# EAGLE schematic vhdci-m2m-bmod (EAGLE 6.3)
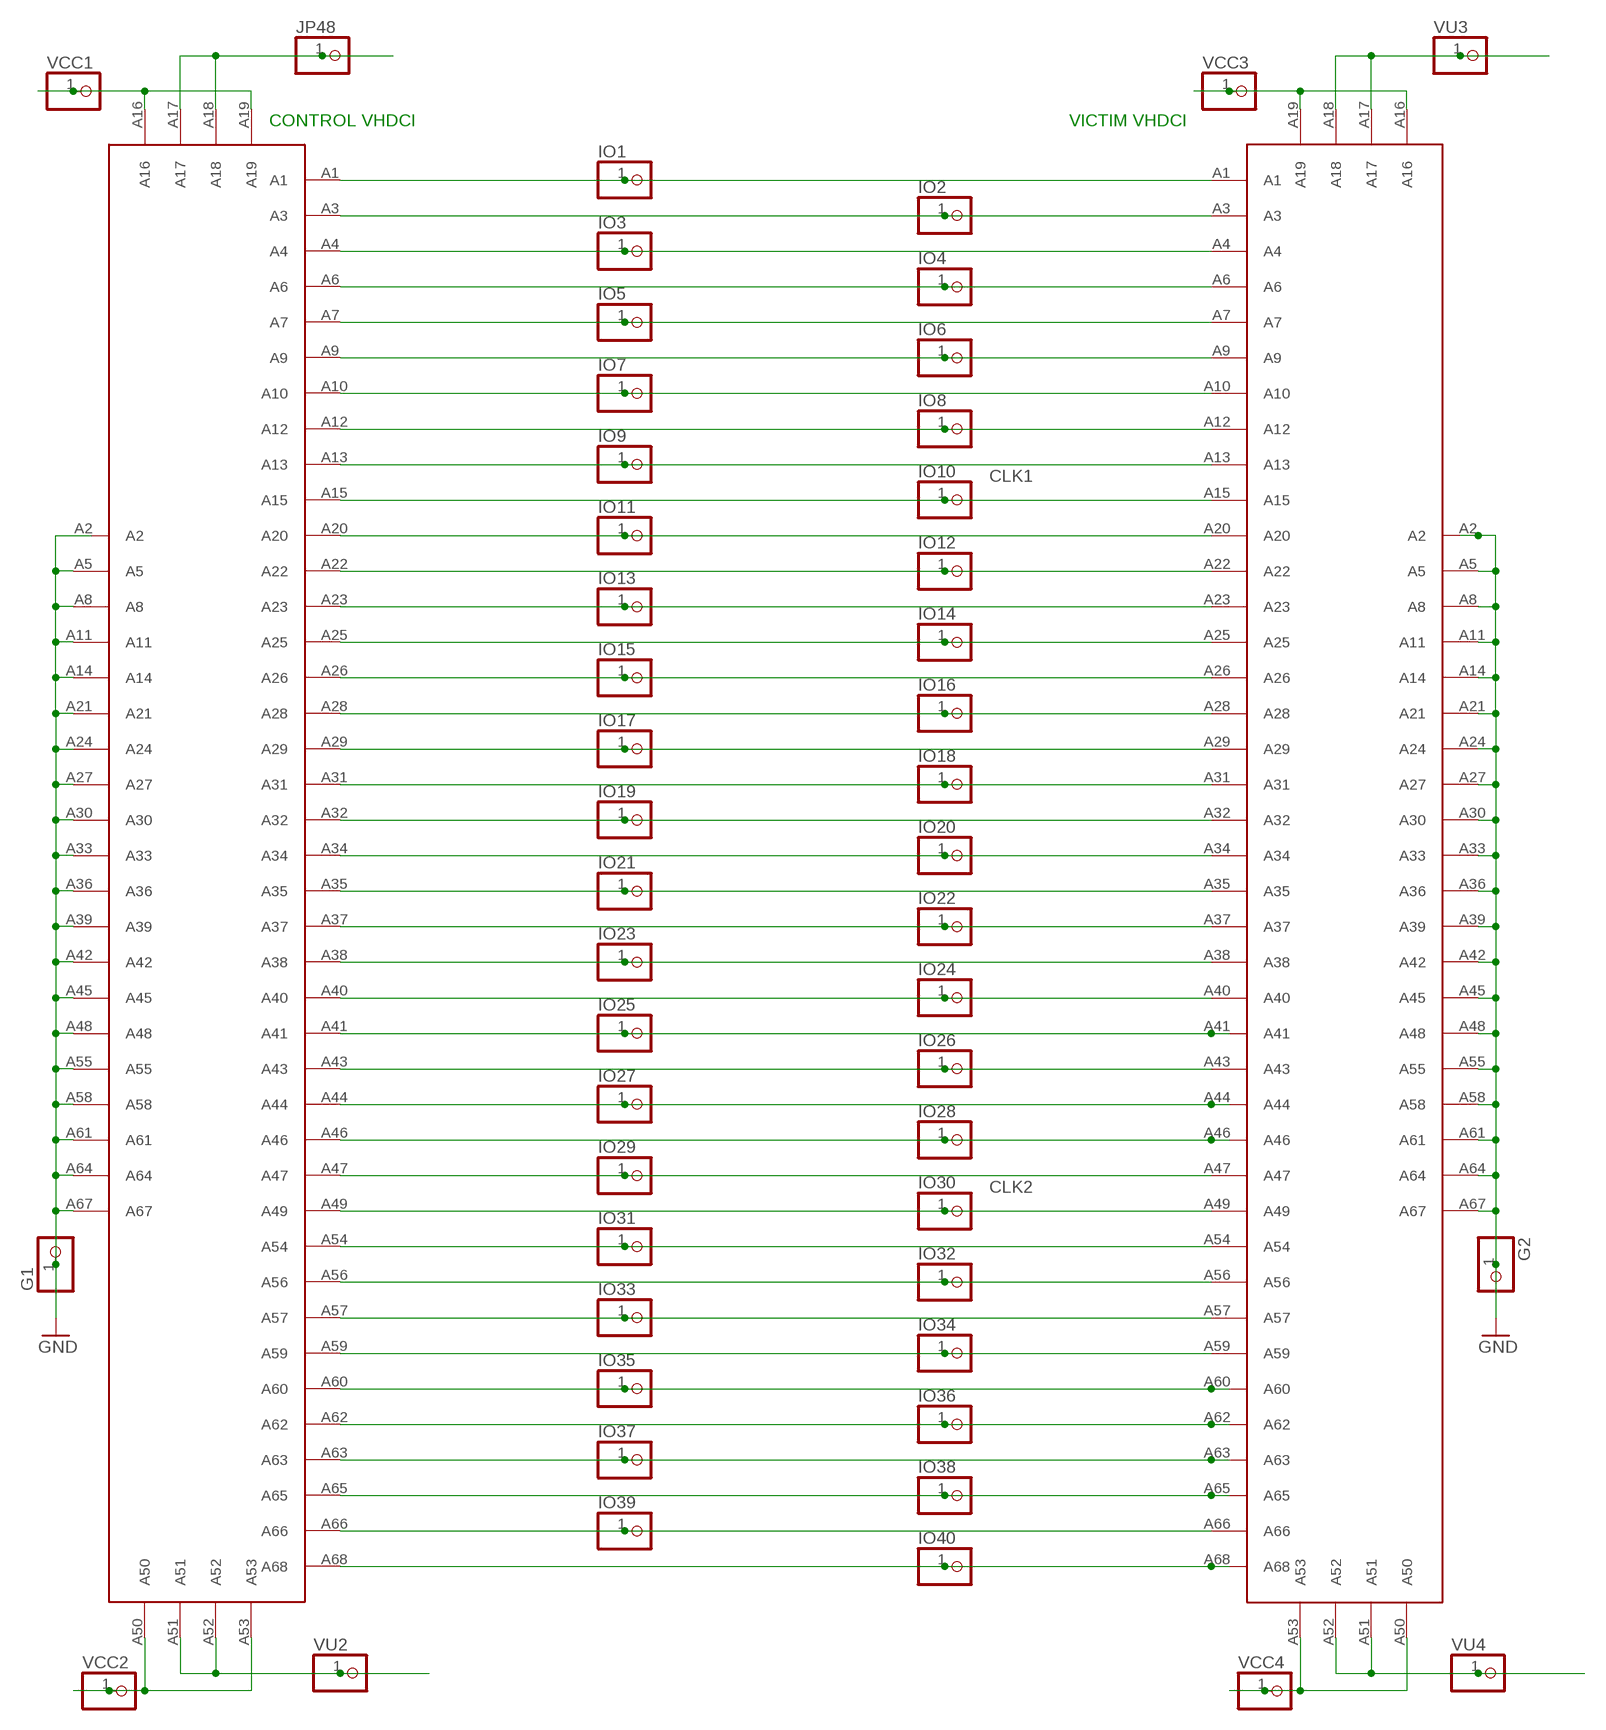
[diagram p0: schematic, sheet 1]

## Parts
G1  PINHD-1X1  [1X01]
G2  PINHD-1X1  [1X01]
IO1  PINHD-1X1  [1X01]
IO2  PINHD-1X1  [1X01]
IO3  PINHD-1X1  [1X01]
IO4  PINHD-1X1  [1X01]
IO5  PINHD-1X1  [1X01]
IO6  PINHD-1X1  [1X01]
IO7  PINHD-1X1  [1X01]
IO8  PINHD-1X1  [1X01]
IO9  PINHD-1X1  [1X01]
IO10  CLK1  PINHD-1X1  [1X01]
IO11  PINHD-1X1  [1X01]
IO12  PINHD-1X1  [1X01]
IO13  PINHD-1X1  [1X01]
IO14  PINHD-1X1  [1X01]
IO15  PINHD-1X1  [1X01]
IO16  PINHD-1X1  [1X01]
IO17  PINHD-1X1  [1X01]
IO18  PINHD-1X1  [1X01]
IO19  PINHD-1X1  [1X01]
IO20  PINHD-1X1  [1X01]
IO21  PINHD-1X1  [1X01]
IO22  PINHD-1X1  [1X01]
IO23  PINHD-1X1  [1X01]
IO24  PINHD-1X1  [1X01]
IO25  PINHD-1X1  [1X01]
IO26  PINHD-1X1  [1X01]
IO27  PINHD-1X1  [1X01]
IO28  PINHD-1X1  [1X01]
IO29  PINHD-1X1  [1X01]
IO30  CLK2  PINHD-1X1  [1X01]
IO31  PINHD-1X1  [1X01]
IO32  PINHD-1X1  [1X01]
IO33  PINHD-1X1  [1X01]
IO34  PINHD-1X1  [1X01]
IO35  PINHD-1X1  [1X01]
IO36  PINHD-1X1  [1X01]
IO37  PINHD-1X1  [1X01]
IO38  PINHD-1X1  [1X01]
IO39  PINHD-1X1  [1X01]
IO40  PINHD-1X1  [1X01]
JP48  PINHD-1X1  [1X01]
U$1  CON-VHDCI-68PIN-MALE  [CON-VHDCI-68PIN-MALE]
U$2  CON-VHDCI-68PIN-MALE  [CON-VHDCI-68PIN-MALE]
VCC1  PINHD-1X1  [1X01]
VCC2  PINHD-1X1  [1X01]
VCC3  PINHD-1X1  [1X01]
VCC4  PINHD-1X1  [1X01]
VU2  PINHD-1X1  [1X01]
VU3  PINHD-1X1  [1X01]
VU4  PINHD-1X1  [1X01]

## Nets
GND: G1.1 G2.1 U$1.A5 U$1.A8 U$1.A11 U$1.A14 U$1.A21 U$1.A24 U$1.A27 U$1.A30 U$1.A33 U$1.A36 U$1.A39 U$1.A42 U$1.A45 U$1.A48 U$1.A55 U$1.A58 U$1.A61 U$1.A64 U$1.A67 U$2.A2 U$2.A5 U$2.A8 U$2.A11 U$2.A14 U$2.A21 U$2.A24 U$2.A27 U$2.A30 U$2.A33 U$2.A36 U$2.A39 U$2.A42 U$2.A45 U$2.A48 U$2.A55 U$2.A58 U$2.A61 U$2.A64 U$2.A67
N$1: IO1.1 IO2.1 IO3.1 IO4.1 IO5.1 IO6.1 IO7.1 IO8.1 U$1.A1 U$2.A1 U$2.A3 U$2.A4 U$2.A6 U$2.A7 U$2.A9 U$2.A10 U$2.A12
N$2: IO9.1 U$1.A13 U$2.A13
N$3: IO10.1 U$1.A15 U$2.A15
N$4: IO11.1 U$1.A20 U$2.A20
N$5: IO12.1 U$1.A22 U$2.A22
N$6: IO13.1 U$1.A23 U$2.A23
N$7: IO14.1 U$1.A25 U$2.A25
N$8: IO15.1 U$1.A26 U$2.A26
N$9: IO16.1 U$1.A28 U$2.A28
N$10: IO17.1 U$1.A29 U$2.A29
N$11: IO18.1 U$1.A31 U$2.A31
N$12: IO19.1 U$1.A32 U$2.A32
N$13: IO20.1 U$1.A34 U$2.A34
N$14: IO21.1 U$1.A35 U$2.A35
N$15: IO22.1 U$1.A37 U$2.A37
N$16: IO23.1 U$1.A38 U$2.A38
N$17: IO24.1 U$1.A40 U$2.A40
N$18: IO25.1 U$1.A41 U$2.A41
N$19: IO26.1 U$1.A43 U$2.A43
N$20: IO27.1 U$1.A44 U$2.A44
N$21: IO28.1 U$1.A46 U$2.A46
N$22: IO29.1 U$1.A47 U$2.A47
N$23: IO30.1 U$1.A49 U$2.A49
N$24: IO31.1 U$1.A54 U$2.A54
N$25: IO32.1 U$1.A56 U$2.A56
N$26: IO33.1 U$1.A57 U$2.A57
N$27: IO34.1 U$1.A59 U$2.A59
N$28: IO35.1 U$1.A60 U$2.A60
N$29: IO36.1 U$1.A62 U$2.A62
N$30: IO37.1 U$1.A63 U$2.A63
N$31: IO38.1 U$1.A65 U$2.A65
N$32: IO39.1 U$1.A66 U$2.A66
N$33: IO40.1 U$1.A68 U$2.A68
N$35: U$1.A16 U$1.A19 VCC1.1
N$36: U$2.A16 U$2.A19 VCC3.1
N$38: U$2.A17 U$2.A18 VU3.1
N$40: U$1.A51 U$1.A52 VU2.1
N$41: U$1.A50 U$1.A53 VCC2.1
N$42: U$2.A51 U$2.A52 VU4.1
N$43: U$2.A50 U$2.A53 VCC4.1
VU1: JP48.1 U$1.A17 U$1.A18
Unconnected: U$1.A2 U$1.A3 U$1.A4 U$1.A6 U$1.A7 U$1.A9 U$1.A10 U$1.A12

## Notes on the sheet
- CONTROL VHDCI | VICTIM VHDCI

## Library data of the parts
G1 G2 IO1-IO40 JP48 VCC1-VCC4 VU2-VU4 = adafruit:PINHD-1X1: Pin header 1x1 for 0.1" spacing With round pins
U$1 U$2 = con-vhdci-68pin-male:CON-VHDCI-68PIN-MALE: VHDCI MALE 68 PIN CONNECTOR Used to connect two boards with VHDCI connectors. 40 Pin I/O 20 Pins connected to ground 4 Pins Connected to "Vu" 4 Pins Connected to "VCC" Developed by CERG